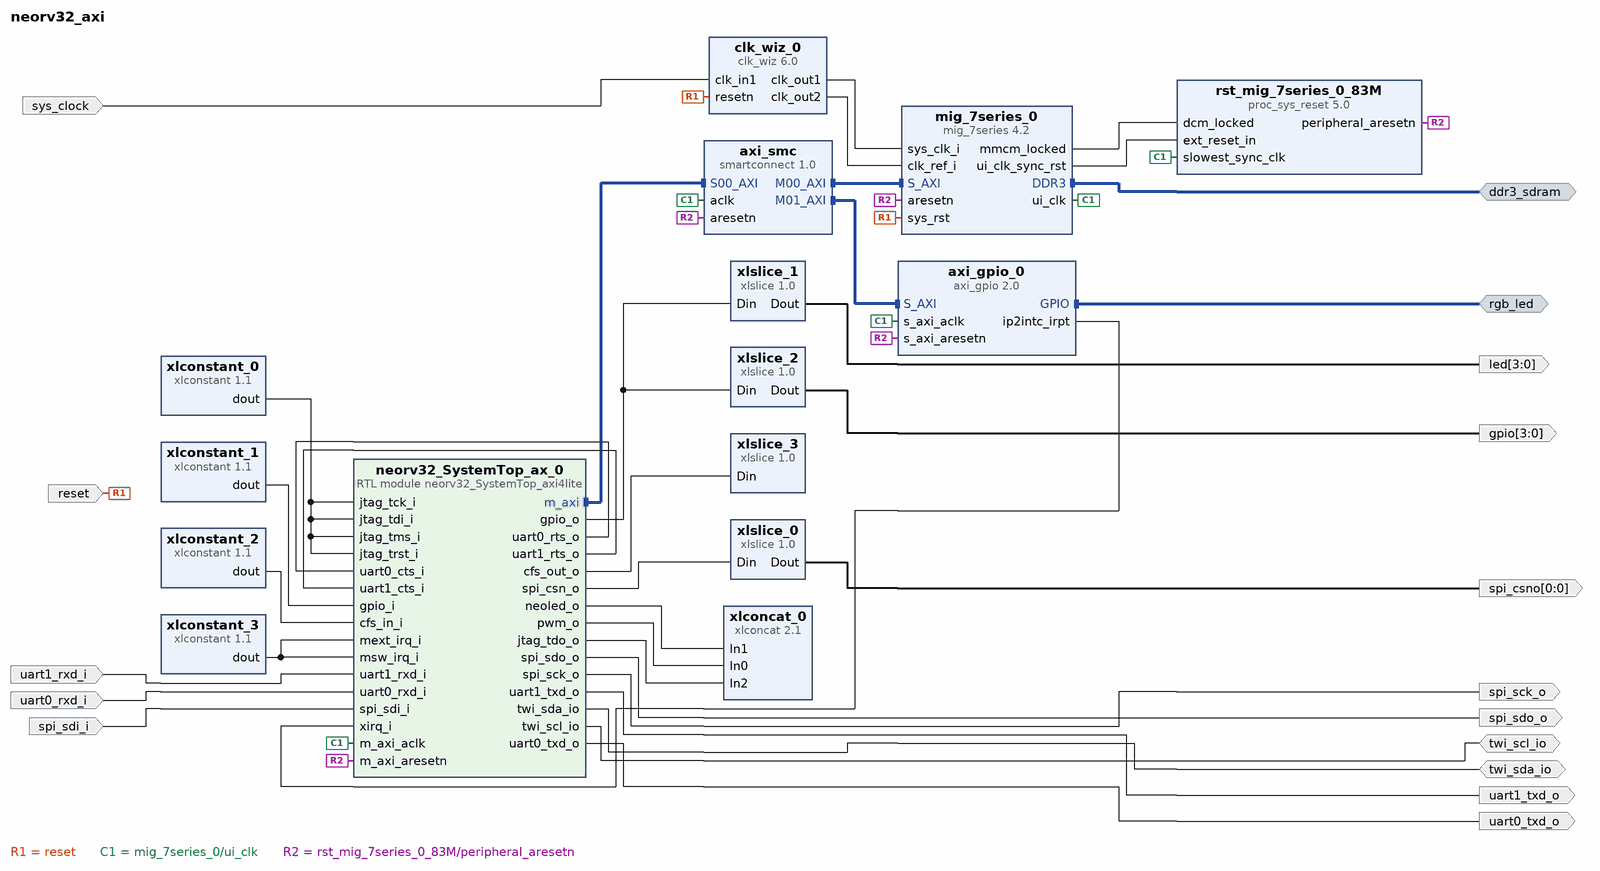
[diagram p0: block diagram of the top level]
# Vivado block design neorv32_axi, xc7a100tcsg324-1, Vivado 2020.2
create_bd_design neorv32_axi

create_bd_intf_port -mode Master -vlnv xilinx.com:interface:ddrx_rtl:1.0 ddr3_sdram
create_bd_intf_port -mode Master -vlnv xilinx.com:interface:gpio_rtl:1.0 rgb_led
create_bd_port -dir I -type clk sys_clock
set_property -dict {CONFIG.ASSOCIATED_RESET reset CONFIG.FREQ_HZ 100000000 CONFIG.PHASE 0.000} [get_bd_ports sys_clock]
create_bd_port -dir I -type rst reset
set_property -dict {CONFIG.POLARITY ACTIVE_LOW} [get_bd_ports reset]
create_bd_port -dir I uart1_rxd_i
create_bd_port -dir I uart0_rxd_i
create_bd_port -dir I spi_sdi_i
create_bd_port -dir O uart1_txd_o
create_bd_port -dir O spi_sdo_o
create_bd_port -dir O spi_sck_o
create_bd_port -dir IO twi_sda_io
create_bd_port -dir IO twi_scl_io
create_bd_port -dir O -from 0 -to 0 spi_csno
create_bd_port -dir O -from 3 -to 0 led
create_bd_port -dir O -from 3 -to 0 gpio
create_bd_port -dir O uart0_txd_o

create_bd_cell -type ip -vlnv xilinx.com:ip:clk_wiz:6.0 clk_wiz_0
set_property -dict [list \
  CONFIG.CLKOUT1_JITTER 118.758 \
  CONFIG.CLKOUT1_REQUESTED_OUT_FREQ 166.66667 \
  CONFIG.CLKOUT2_JITTER 114.829 \
  CONFIG.CLKOUT2_PHASE_ERROR 98.575 \
  CONFIG.CLKOUT2_REQUESTED_OUT_FREQ 200.000 \
  CONFIG.CLKOUT2_USED true \
  CONFIG.CLKOUT3_JITTER 130.958 \
  CONFIG.CLKOUT3_PHASE_ERROR 98.575 \
  CONFIG.CLKOUT3_REQUESTED_OUT_FREQ 100.000 \
  CONFIG.CLKOUT3_USED false \
  CONFIG.CLKOUT4_JITTER 130.958 \
  CONFIG.CLKOUT4_PHASE_ERROR 98.575 \
  CONFIG.CLKOUT4_USED false \
  CONFIG.CLK_IN1_BOARD_INTERFACE sys_clock \
  CONFIG.MMCM_CLKOUT0_DIVIDE_F 6.000 \
  CONFIG.MMCM_CLKOUT1_DIVIDE 5 \
  CONFIG.MMCM_CLKOUT2_DIVIDE 1 \
  CONFIG.MMCM_CLKOUT3_DIVIDE 1 \
  CONFIG.NUM_OUT_CLKS 2 \
  CONFIG.RESET_BOARD_INTERFACE reset \
  CONFIG.RESET_PORT resetn \
  CONFIG.RESET_TYPE ACTIVE_LOW \
  CONFIG.USE_BOARD_FLOW true \
] [get_bd_cells clk_wiz_0]
create_bd_cell -type ip -vlnv xilinx.com:ip:mig_7series:4.2 mig_7series_0
set_property -dict {CONFIG.BOARD_MIG_PARAM ddr3_sdram CONFIG.RESET_BOARD_INTERFACE reset} [get_bd_cells mig_7series_0]
create_bd_cell -type ip -vlnv xilinx.com:ip:smartconnect:1.0 axi_smc
set_property -dict {CONFIG.NUM_MI 2 CONFIG.NUM_SI 1} [get_bd_cells axi_smc]
create_bd_cell -type ip -vlnv xilinx.com:ip:proc_sys_reset:5.0 rst_mig_7series_0_83M
create_bd_cell -type ip -vlnv xilinx.com:ip:xlconstant:1.1 xlconstant_0
set_property -dict {CONFIG.CONST_WIDTH 4} [get_bd_cells xlconstant_0]
create_bd_cell -type ip -vlnv xilinx.com:ip:xlconstant:1.1 xlconstant_1
set_property -dict {CONFIG.CONST_VAL 0 CONFIG.CONST_WIDTH 64} [get_bd_cells xlconstant_1]
create_bd_cell -type ip -vlnv xilinx.com:ip:xlconstant:1.1 xlconstant_2
set_property -dict {CONFIG.CONST_WIDTH 32} [get_bd_cells xlconstant_2]
create_bd_cell -type ip -vlnv xilinx.com:ip:xlconstant:1.1 xlconstant_3
set_property -dict {CONFIG.CONST_WIDTH 2} [get_bd_cells xlconstant_3]
create_bd_cell -type ip -vlnv xilinx.com:ip:xlslice:1.0 xlslice_0
set_property -dict {CONFIG.DIN_WIDTH 8} [get_bd_cells xlslice_0]
create_bd_cell -type ip -vlnv xilinx.com:ip:xlslice:1.0 xlslice_1
set_property -dict {CONFIG.DIN_FROM 3 CONFIG.DIN_WIDTH 64 CONFIG.DOUT_WIDTH 4} [get_bd_cells xlslice_1]
create_bd_cell -type ip -vlnv xilinx.com:ip:xlslice:1.0 xlslice_2
set_property -dict {CONFIG.DIN_FROM 7 CONFIG.DIN_TO 4 CONFIG.DIN_WIDTH 64 CONFIG.DOUT_WIDTH 4} [get_bd_cells xlslice_2]
create_bd_cell -type ip -vlnv xilinx.com:ip:xlslice:1.0 xlslice_3
create_bd_cell -type ip -vlnv xilinx.com:ip:xlconcat:2.1 xlconcat_0
set_property -dict {CONFIG.NUM_PORTS 3} [get_bd_cells xlconcat_0]
create_bd_cell -type ip -vlnv xilinx.com:ip:axi_gpio:2.0 axi_gpio_0
set_property -dict [list \
  CONFIG.C_INTERRUPT_PRESENT 1 \
  CONFIG.GPIO_BOARD_INTERFACE rgb_led \
  CONFIG.USE_BOARD_FLOW true \
] [get_bd_cells axi_gpio_0]
create_bd_cell -type module -reference neorv32_SystemTop_axi4lite neorv32_SystemTop_ax_0

# ---- connections ----

connect_bd_intf_net [get_bd_intf_pins axi_smc/M00_AXI] [get_bd_intf_pins mig_7series_0/S_AXI]
connect_bd_intf_net [get_bd_intf_pins axi_smc/M01_AXI] [get_bd_intf_pins axi_gpio_0/S_AXI]
connect_bd_intf_net [get_bd_intf_pins neorv32_SystemTop_ax_0/m_axi] [get_bd_intf_pins axi_smc/S00_AXI]
connect_bd_intf_net [get_bd_intf_ports ddr3_sdram] [get_bd_intf_pins mig_7series_0/DDR3]
connect_bd_intf_net [get_bd_intf_ports rgb_led] [get_bd_intf_pins axi_gpio_0/GPIO]
connect_bd_net [get_bd_ports sys_clock] [get_bd_pins clk_wiz_0/clk_in1]
connect_bd_net [get_bd_pins clk_wiz_0/clk_out1] [get_bd_pins mig_7series_0/sys_clk_i]
connect_bd_net [get_bd_pins clk_wiz_0/clk_out2] [get_bd_pins mig_7series_0/clk_ref_i]
connect_bd_net -net reset_0_1 [get_bd_ports reset] [get_bd_pins clk_wiz_0/resetn] [get_bd_pins mig_7series_0/sys_rst]
connect_bd_net [get_bd_pins mig_7series_0/ui_clk] \
  [get_bd_pins axi_smc/aclk] [get_bd_pins rst_mig_7series_0_83M/slowest_sync_clk] [get_bd_pins axi_gpio_0/s_axi_aclk] \
  [get_bd_pins neorv32_SystemTop_ax_0/m_axi_aclk]
connect_bd_net [get_bd_pins mig_7series_0/mmcm_locked] [get_bd_pins rst_mig_7series_0_83M/dcm_locked]
connect_bd_net [get_bd_pins mig_7series_0/ui_clk_sync_rst] [get_bd_pins rst_mig_7series_0_83M/ext_reset_in]
connect_bd_net [get_bd_pins rst_mig_7series_0_83M/peripheral_aresetn] \
  [get_bd_pins mig_7series_0/aresetn] [get_bd_pins axi_smc/aresetn] [get_bd_pins axi_gpio_0/s_axi_aresetn] \
  [get_bd_pins neorv32_SystemTop_ax_0/m_axi_aresetn]
connect_bd_net [get_bd_pins xlconstant_0/dout] \
  [get_bd_pins neorv32_SystemTop_ax_0/jtag_trst_i] [get_bd_pins neorv32_SystemTop_ax_0/jtag_tck_i] \
  [get_bd_pins neorv32_SystemTop_ax_0/jtag_tdi_i] [get_bd_pins neorv32_SystemTop_ax_0/jtag_tms_i]
connect_bd_net [get_bd_pins xlconstant_1/dout] [get_bd_pins neorv32_SystemTop_ax_0/gpio_i]
connect_bd_net [get_bd_pins xlconstant_2/dout] [get_bd_pins neorv32_SystemTop_ax_0/cfs_in_i]
connect_bd_net [get_bd_pins xlconstant_3/dout] [get_bd_pins neorv32_SystemTop_ax_0/msw_irq_i] [get_bd_pins neorv32_SystemTop_ax_0/mext_irq_i]
connect_bd_net -net uart1_rxd_i_0_1 [get_bd_ports uart1_rxd_i] [get_bd_pins neorv32_SystemTop_ax_0/uart1_rxd_i]
connect_bd_net -net uart0_rxd_i_0_1 [get_bd_ports uart0_rxd_i] [get_bd_pins neorv32_SystemTop_ax_0/uart0_rxd_i]
connect_bd_net -net spi_sdi_i_0_1 [get_bd_ports spi_sdi_i] [get_bd_pins neorv32_SystemTop_ax_0/spi_sdi_i]
connect_bd_net [get_bd_pins neorv32_SystemTop_ax_0/uart0_rts_o] [get_bd_pins neorv32_SystemTop_ax_0/uart0_cts_i]
connect_bd_net [get_bd_pins neorv32_SystemTop_ax_0/uart1_rts_o] [get_bd_pins neorv32_SystemTop_ax_0/uart1_cts_i]
connect_bd_net [get_bd_pins neorv32_SystemTop_ax_0/uart1_txd_o] [get_bd_ports uart1_txd_o]
connect_bd_net [get_bd_pins neorv32_SystemTop_ax_0/spi_sdo_o] [get_bd_ports spi_sdo_o]
connect_bd_net [get_bd_pins neorv32_SystemTop_ax_0/spi_sck_o] [get_bd_ports spi_sck_o]
connect_bd_net [get_bd_ports twi_sda_io] [get_bd_pins neorv32_SystemTop_ax_0/twi_sda_io]
connect_bd_net [get_bd_ports twi_scl_io] [get_bd_pins neorv32_SystemTop_ax_0/twi_scl_io]
connect_bd_net [get_bd_pins neorv32_SystemTop_ax_0/spi_csn_o] [get_bd_pins xlslice_0/Din]
connect_bd_net [get_bd_pins xlslice_0/Dout] [get_bd_ports spi_csno]
connect_bd_net [get_bd_pins neorv32_SystemTop_ax_0/gpio_o] [get_bd_pins xlslice_1/Din] [get_bd_pins xlslice_2/Din]
connect_bd_net [get_bd_pins xlslice_1/Dout] [get_bd_ports led]
connect_bd_net [get_bd_pins xlslice_2/Dout] [get_bd_ports gpio]
connect_bd_net [get_bd_pins neorv32_SystemTop_ax_0/cfs_out_o] [get_bd_pins xlslice_3/Din]
connect_bd_net [get_bd_pins neorv32_SystemTop_ax_0/neoled_o] [get_bd_pins xlconcat_0/In1]
connect_bd_net [get_bd_pins neorv32_SystemTop_ax_0/pwm_o] [get_bd_pins xlconcat_0/In0]
connect_bd_net [get_bd_pins neorv32_SystemTop_ax_0/uart0_txd_o] [get_bd_ports uart0_txd_o]
connect_bd_net [get_bd_pins neorv32_SystemTop_ax_0/jtag_tdo_o] [get_bd_pins xlconcat_0/In2]
connect_bd_net [get_bd_pins axi_gpio_0/ip2intc_irpt] [get_bd_pins neorv32_SystemTop_ax_0/xirq_i]

# ---- address map ----
assign_bd_address -offset 0x10000000 -range 256M -target_address_space [get_bd_addr_spaces neorv32_SystemTop_ax_0/m_axi] [get_bd_addr_segs mig_7series_0/memmap/memaddr]
assign_bd_address -offset 0x40000000 -range 64K -target_address_space [get_bd_addr_spaces neorv32_SystemTop_ax_0/m_axi] [get_bd_addr_segs axi_gpio_0/S_AXI/Reg]

validate_bd_design
save_bd_design
